# EAGLE design Y-babies ATtiny84 (EAGLE 6.5.0)
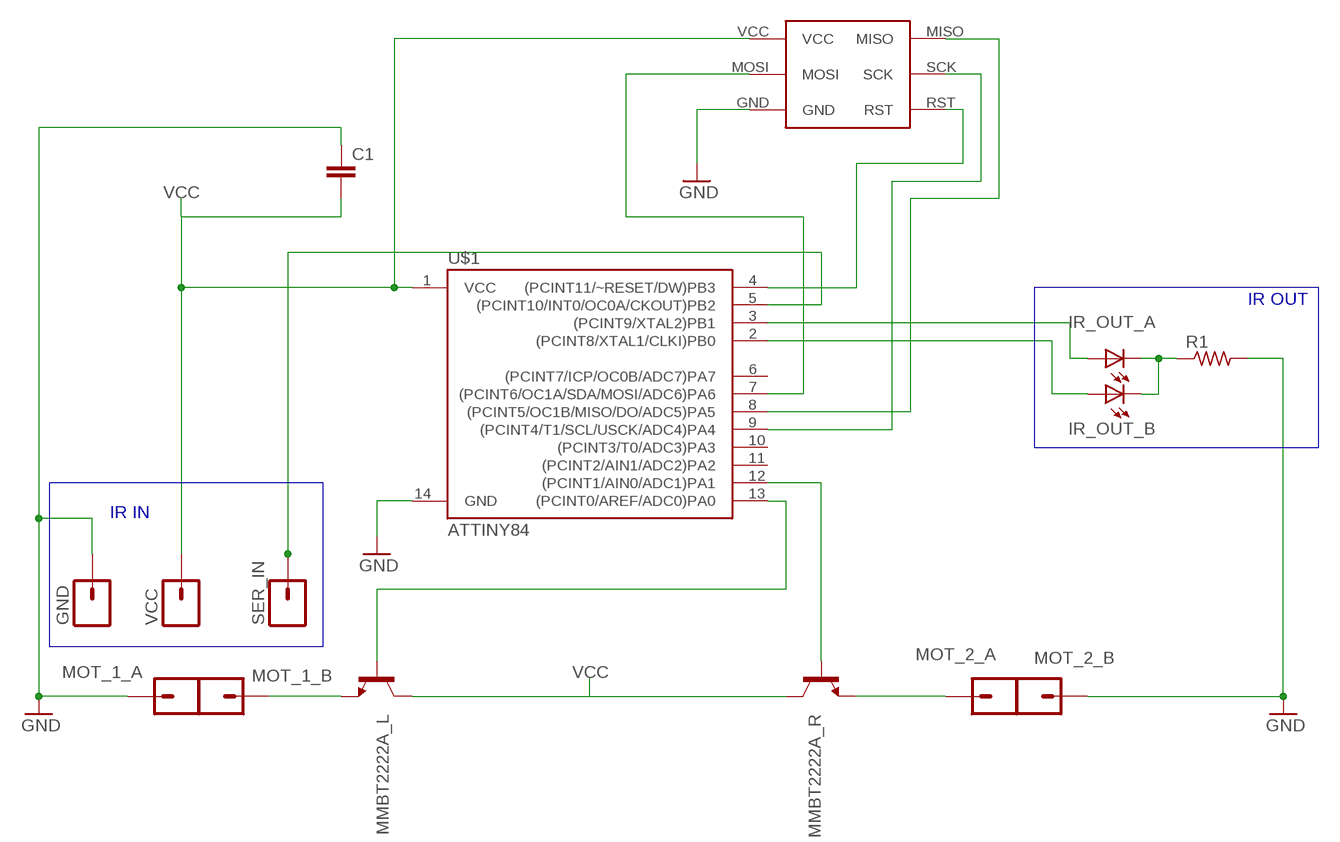
[diagram p0: schematic, sheet 1]

## Parts
C1  CAPSMD  [GRM43D]
GND  M01PTH  [1X01]
IR_OUT_A  LED3MM  [LED3MM]
IR_OUT_B  LED3MM  [LED3MM]
MMBT2222A_L  TRANSISTOR_NPNSOT23  [SOT23]
MMBT2222A_R  TRANSISTOR_NPNSOT23  [SOT23]
MOT_1_A  M01SMD-4.5X1.5  [PAD-1.5X4.5]
MOT_1_B  M01SMD-4.5X1.5  [PAD-1.5X4.5]
MOT_2_A  M01SMD-4.5X1.5  [PAD-1.5X4.5]
MOT_2_B  M01SMD-4.5X1.5  [PAD-1.5X4.5]
R1  R-US_R0805W  [R0805W]
SER_IN  M01PTH  [1X01]
U$1  ATTINY84  [SO14]
U$2  POGO_PIN_SPI_PAD  [POGO_PIN_SPI_PAD]
VCC  M01PTH  [1X01]

## Nets
GND: C1.A GND.1 MOT_1_A.P$1 MOT_2_B.P$1 R1.2 U$1.14(GND) U$2.GND
N$3: IR_OUT_B.A U$1.2((PCINT8/XTAL1/CLKI)PB0)
N$5: U$1.4((PCINT11/~RESET/DW)PB3) U$2.RST
N$6: IR_OUT_A.A U$1.3((PCINT9/XTAL2)PB1)
N$7: IR_OUT_A.K(C) IR_OUT_B.K(C) R1.1
N$8: SER_IN.1 U$1.5((PCINT10/INT0/OC0A/CKOUT)PB2)
N$9: MMBT2222A_L.2(E) MOT_1_B.P$1
N$10: MMBT2222A_R.2(E) MOT_2_A.P$1
N$11: U$1.9((PCINT4/T1/SCL/USCK/ADC4)PA4) U$2.SCK
N$12: U$1.8((PCINT5/OC1B/MISO/DO/ADC5)PA5) U$2.MISO
N$13: U$1.7((PCINT6/OC1A/SDA/MOSI/ADC6)PA6) U$2.MOSI
N$14: MMBT2222A_L.1(B) U$1.13((PCINT0/AREF/ADC0)PA0)
N$15: MMBT2222A_R.1(B) U$1.12((PCINT1/AIN0/ADC1)PA1)
VCC: C1.C MMBT2222A_L.3(C) MMBT2222A_R.3(C) U$1.1(VCC) U$2.VCC VCC.1
Unconnected: U$1.6((PCINT7/ICP/OC0B/ADC7)PA7) U$1.10((PCINT3/T0/ADC3)PA3) U$1.11((PCINT2/AIN1/ADC2)PA2)

## Buses
B$1
B$2

## Notes on the sheet
- IR OUT
- IR IN

## Library data of the parts
C1 = SparkFun:CAP: Capacitor Standard 0603 ceramic capacitor, and 0.1" leaded capacitor.
GND MOT_1_A MOT_1_B MOT_2_A MOT_2_B SER_IN VCC = SparkFun:M01: Header 1 Standard 1-pin 0.1" header. Use with straight break away headers (SKU : PRT-00116), right angle break away headers (PRT-00553), swiss pins (PRT-00743), machine pins (PRT-00117), and female headers (PRT-00115).
IR_OUT_A IR_OUT_B = led:LED: LED OSRAM: - CHIPLED LG R971, LG N971, LY N971, LG Q971, LY Q971, LO R971, LY R971 LH N974, LH R974 LS Q976, LO Q976, LY Q976 LO Q996 - Hyper CHIPLED LW Q18S LB Q993, LB Q99A, LB R99A - SideLED LS A670, LO A670, LY A670, LG A670, LP A670 LB A673, LV A673, LT A673, LW A673 LH A674 LY A675 LS A676, LA A676, LO A676, LY A676, LW A676 LS A679, LY A679, LG A679 - Hyper Micro SIDELED® LS Y876, LA Y876, LO Y876, LY Y876 LT Y87S - SmartLED LW L88C, LW L88S LB L89C, LB L89S, LG L890 LS L89K, LO L89K, LY L89K LS L896, LA L896, LO L896, LY L896 - TOPLED LS T670, LO T670, LY T670, LG T670, LP T670 LSG T670, LSP T670, LSY T670, LOP T670, LYG T670 LG T671, LOG T671, LSG T671 LB T673, LV T673, LT T673, LW T673 LH T674 LS T676, LA T676, LO T676, LY T676, LB T676, LH T676, LSB T676, LW T676 LB T67C, LV T67C, LT T67C, LS T67K, LO T67K, LY T67K, LW E67C LS E67B, LA E67B, LO E67B, LY E67B, LB E67C, LV E67C, LT E67C LW T67C LS T679, LY T679, LG T679 LS T770, LO T770, LY T770, LG T770, LP T770 LB T773, LV T773, LT T773, LW T773 LH T774 LS E675, LA E675, LY E675, LS T675 LS T776, LA T776, LO T776, LY T776, LB T776 LHGB T686 LT T68C, LB T68C - Hyper Mini TOPLED® LB M676 - Mini TOPLED Santana® LG M470 LS M47K, LO M47K, LY M47K Source: http://www.osram.convergy.de LUXEON: - LUMILED® LXK2-PW12-R00, LXK2-PW12-S00, LXK2-PW14-U00, LXK2-PW14-V00 LXK2-PM12-R00, LXK2-PM12-S00, LXK2-PM14-U00 LXK2-PE12-Q00, LXK2-PE12-R00, LXK2-PE12-S00, LXK2-PE14-T00, LXK2-PE14-U00 LXK2-PB12-K00, LXK2-PB12-L00, LXK2-PB12-M00, LXK2-PB14-N00, LXK2-PB14-P00, LXK2-PB14-Q00 LXK2-PR12-L00, LXK2-PR12-M00, LXK2-PR14-Q00, LXK2-PR14-R00 LXK2-PD12-Q00, LXK2-PD12-R00, LXK2-PD12-S00 LXK2-PH12-R00, LXK2-PH12-S00 LXK2-PL12-P00, LXK2-PL12-Q00, LXK2-PL12-R00 Source: www.luxeon.com KINGBRIGHT: KA-3528ASYC Source: www.kingbright.com
MMBT2222A_L MMBT2222A_R = SparkFun:TRANSISTOR_NPN: Transistor NPN BJT configuration in SOT23 package. MMBT2222 is the common NPN we use. Double check BCE configuration again layout.
R1 = resistor:R-US_: RESISTOR, American symbol
U$1 = SparkFun-DigitalIC:ATTINY84: Atmel 14-pin 2/4/8kB flash uC
U$2 = Random parts:POGO_PIN_SPI_PAD

## Board
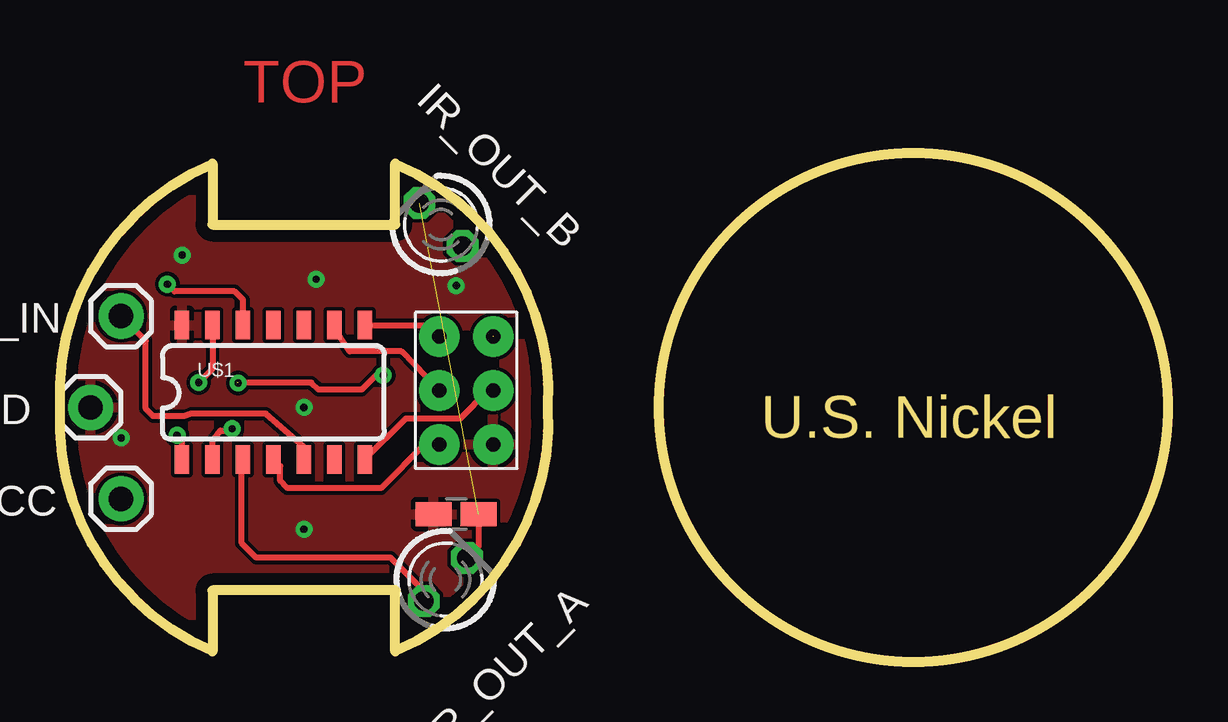
[diagram p1: board, top side]
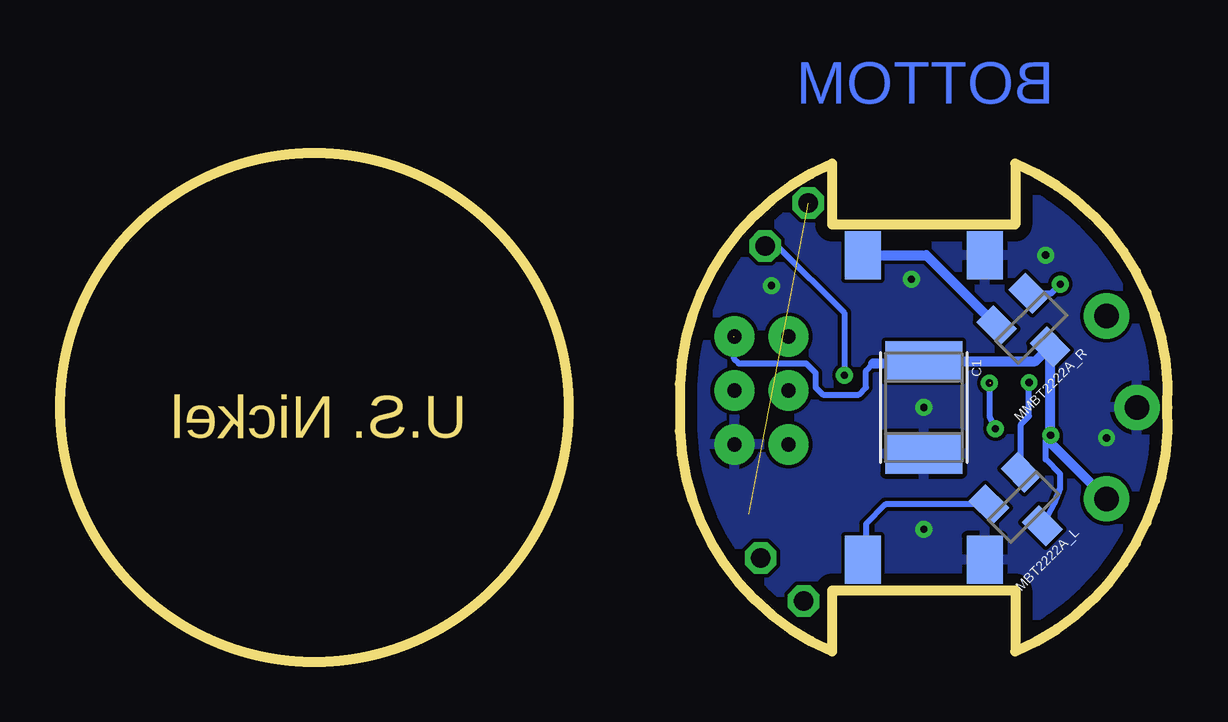
[diagram p2: board, bottom side, seen from below]

Size 46.17 x 21.21 mm. Coordinates in mm from the lower left corner, seen from the top.
Outline: 20.33,10.61 arc-70 13.98,0.45 13.98,2.99 6.36,2.99 6.36,0.45 arc-70 0.01,10.61 arc-70 6.36,20.77 6.36,18.23 13.98,18.23 13.98,20.77 arc-70 20.33,10.61
Outline: circle at 35.57,10.61 radius 10.61
Copper layers (1*16): Top 0.035mm / dielectric 1.5mm / Bottom 0.035mm
Design rules "default *": minimum track width 10mil, minimum drill 24mil, track to track 6mil, track to pad 6mil, pad to pad 6mil, via to via 6mil, smd to smd 6mil, copper to edge 20mil, drill to drill 8mil, minimum pad ring 10mil, minimum via ring 8mil, stop-mask expansion 4mil, vias tented up to drill 0mil, thermal gap 8mil

### Footprints (pad centres in the part's own frame; a part is rotated, then mirrored left to right if it is on the bottom)
GRM43D = smd 1.65 x 3.2: A 1.927,0; C -1.927,0
1X01 = drill 1.016 pad 1.88: 1 0,0
LED3MM = drill 0.813 octagon: A -1.27,0; K 1.27,0
SOT23 = smd 1 x 1.4: 1 -0.95,-1.1; 2 0.95,-1.1; 3 0,1.1
PAD-1.5X4.5 = smd 1.5 x 2: P$1 0,0
R0805W = smd 1.5 x 1: 1 -0.94,0; 2 0.94,0
SO14 = smd 0.6 x 1.2: 1 -3.81,-2.8; 2 -2.54,-2.8; 3 -1.27,-2.8; 4 0,-2.8; 5 1.27,-2.8; 6 2.54,-2.8; 7 3.81,-2.8; 8 3.81,2.8; 9 2.54,2.8; 10 1.27,2.8; 11 0,2.8; 12 -1.27,2.8; 13 -2.54,2.8; 14 -3.81,2.8
POGO_PIN_SPI_PAD = drill 0.6 pad 1.676: GND 1,-1; MISO 3.25,-5.5; MOSI 1,-3.25; RST 3.25,-1; SCK 3.25,-3.25; VCC 1,-5.5

### Placement (x,y rotation side)
C1  10.17,10.61 270 bottom
GND  1.28,10.61 0 top
IR_OUT_A  16.07,3.43 45 top
IR_OUT_B  15.88,18.23 135 top
MMBT2222A_L  6.01,6.46 225 bottom
MMBT2222A_R  5.68,13.91 225 bottom
MOT_1_A  7.63,16.96 0 bottom
MOT_1_B  12.71,4.26 0 bottom
MOT_2_A  12.71,16.96 0 bottom
MOT_2_B  7.63,4.26 0 bottom
R1  16.52,6.16 180 top
SER_IN  2.55,14.42 0 top
U$1  8.9,11.24 0 top
U$2  19.06,8.07 180 top
VCC  2.55,6.79 0 top

### Tracks (layer width: path | path; a pad name or v marks a point on that pad's centre or on a via)
GND  (via drill 0.3)
  other vias: 10.17,10.61 10.17,5.53 2.55,9.34 5.09,16.96 16.52,15.69 10.68,15.95
  pour Bottom: -1.26,23.3 -1.26,0.45 21.6,0.45 21.6,23.3
  pour Top: -1.26,23.3 -1.26,0.45 21.6,0.45 21.6,23.3
N$3  (via drill 0.3)  (1 unrouted)
  Top 0.254: U$1.2 6.36,9.22 6.68,9.64 7.11,9.64 v7.18,9.71 | v13.48,11.95 13.18,11.95 12.58,11.35 10.78,11.35 10.48,11.64 7.38,11.64
  Bottom 0.254: IR_OUT_B.A 16.26,17.33 13.48,14.54 v13.48,11.95 | v7.43,11.62 7.43,10.27 v7.18,9.71
N$5
  Top 0.254: U$2.RST 15.2,9.06 13.38,7.25 9.48,7.25 9.18,7.54 9.18,8.16 U$1.4
N$6
  Top 0.254: IR_OUT_A.A 15.17,2.95 13.78,4.35 8.18,4.35 7.58,4.95 7.58,8.39 U$1.3
N$7  (1 unrouted)
  Top 0.254: R1.1 17.46,4.82 IR_OUT_A.K
N$8
  Top 0.254: U$1.5 10.17,8.96 8.58,10.35 5.48,10.35 5.18,10.25 3.88,10.25 3.58,10.54 3.58,13.38 SER_IN.1
N$9
  Bottom 0.254: MMBT2222A_L.2 11.76,6.56 12.58,5.75 12.58,4.38 MOT_1_B.P$1
N$10
  Bottom 0.406: MOT_2_A.P$1 10.07,16.96 MMBT2222A_R.2
N$11
  Top 0.254: U$2.SCK 14.24,12.95 12.08,12.95 11.38,13.98 U$1.9
N$12
  Top 0.254: U$1.8 15.33,14.04 U$2.MISO
N$13
  Top 0.254: U$2.MOSI 17.85,11.31 16.68,10.14 14.41,10.14 U$1.7
N$14  (via drill 0.3)
  Top 0.254: U$1.13 6.36,12.22 v5.78,11.64
  Bottom 0.254: MMBT2222A_L.1 6.11,9.91 5.78,10.25 v5.78,11.64
N$15  (via drill 0.3)
  Top 0.254: U$1.12 7.63,15.1 7.28,15.45 4.78,15.45 v4.48,15.75
  Bottom 0.254: MMBT2222A_R.1 4.86,15.36 v4.48,15.75
VCC  (via drill 0.3)  (1 unrouted)
  Top 0.254: U$1.1 5.09,9.44 | 5.09,9.44 v4.88,9.45 | 5.09,9.44 5,9.44 4.9,9.34
  Bottom 0.254: 18.08,13.54 18.08,12.64 17.88,12.45 15.08,12.45 14.68,12.04 14.68,11.45 14.38,11.14 12.88,11.14 12.58,11.45 12.58,12.14 12.28,12.45 | 4.9,9.15 4.9,9.27 v4.88,9.45 5.09,9.23 U$1.1 4.48,7.83 4.48,7.25 4.73,6.6 MMBT2222A_L.3
  Bottom 0.406: VCC.1 4.9,9.15 MMBT2222A_R.3 5.51,12.53 C1.C 10.25,12.45 12.28,12.45

### Text on the board
Top: TOP
Bottom: BOTTOM
Dimension: U.S. Nickel
_tsilk: IR / Sense